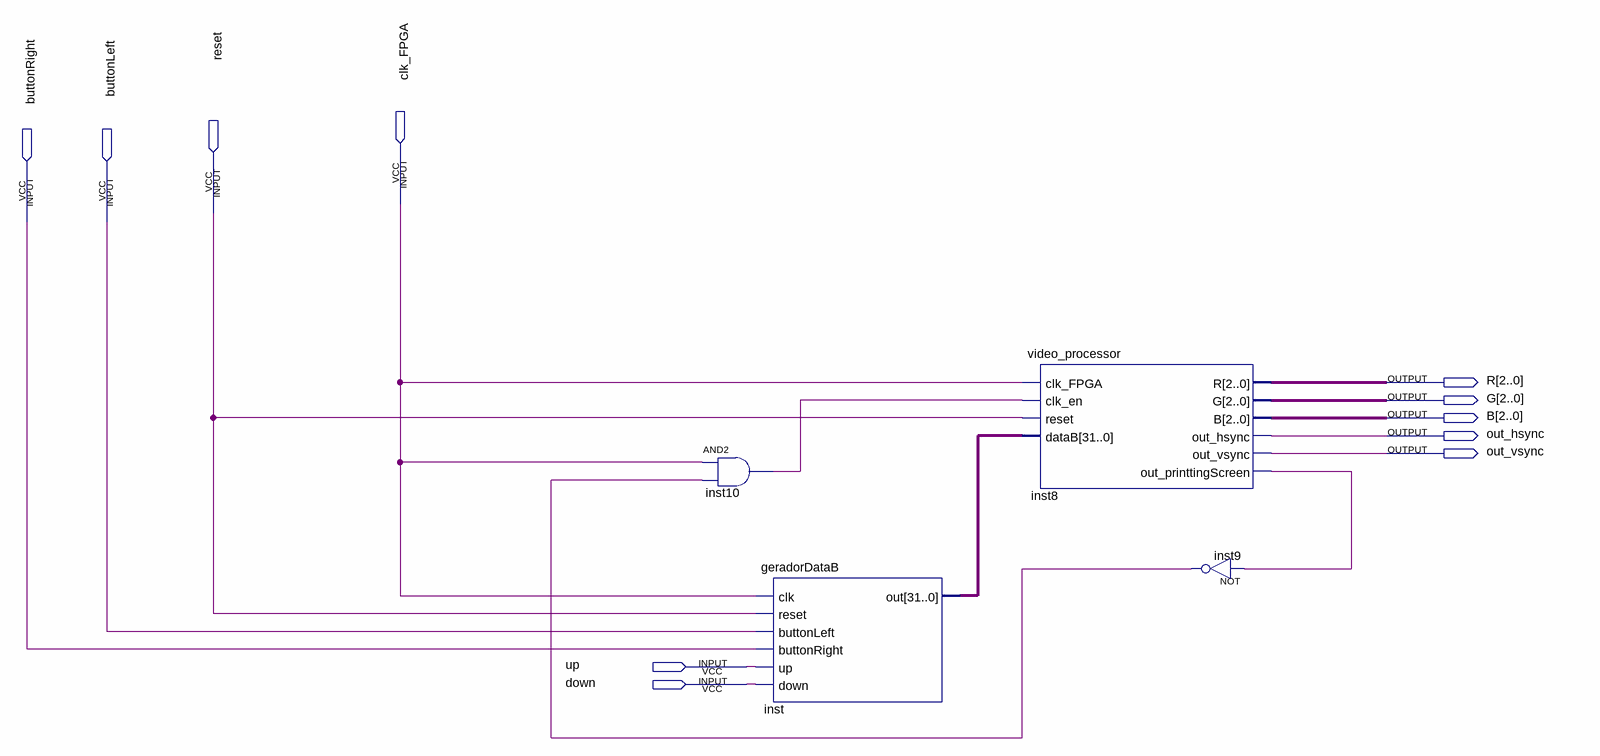
[diagram p0: schematic sheet]
// Quartus schematic Collenda.bdf as structural Verilog: 4 symbols, 11 pins
module Collenda (
  input  clk_FPGA,
  input  reset,
  input  buttonRight,
  input  buttonLeft,
  input  up,
  input  down,
  output [2:0] R,
  output [2:0] G,
  output [2:0] B,
  output out_hsync,
  output out_vsync
);

  wire inst8_out_printtingscreen, inst9_out, inst10_out;
  wire [31:0] inst_out;

  and inst10 (inst10_out, clk_FPGA, inst9_out);
  geradorDataB inst (
    .clk(clk_FPGA), .reset(reset), .buttonLeft(buttonLeft), .buttonRight(buttonRight), .up(up), .down(down),
    .out(inst_out));
  video_processor inst8 (
    .clk_FPGA(clk_FPGA), .clk_en(inst10_out), .reset(reset), .dataB(inst_out), .R(R), .G(G), .B(B),
    .out_hsync(out_hsync), .out_vsync(out_vsync), .out_printtingScreen(inst8_out_printtingscreen));
  not inst9 (inst9_out, inst8_out_printtingscreen);
endmodule
